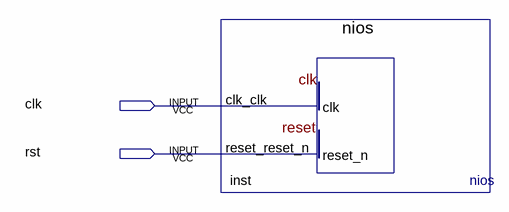
[diagram p0: schematic sheet]
// Quartus schematic TOP.bdf as structural Verilog: 1 symbols, 2 pins
module TOP (
  input  clk,
  input  rst
);

  nios inst (.clk_clk(clk), .reset_reset_n(rst));
endmodule
